# Altium schematic sheet lt3042_sch.SchDoc
size A4; Organization1: VINCULADA AO EXÉRCITO BRASILEIRO; Organization2: FÁBRICA DE MATERIAL DE; Organization3: COMUNICAÇÕES E ELETRÔNICA; Organization0: INDÚSTRIA DE MATERIAL BÉLICO DO BRASIL; Esquematico: Esquemático
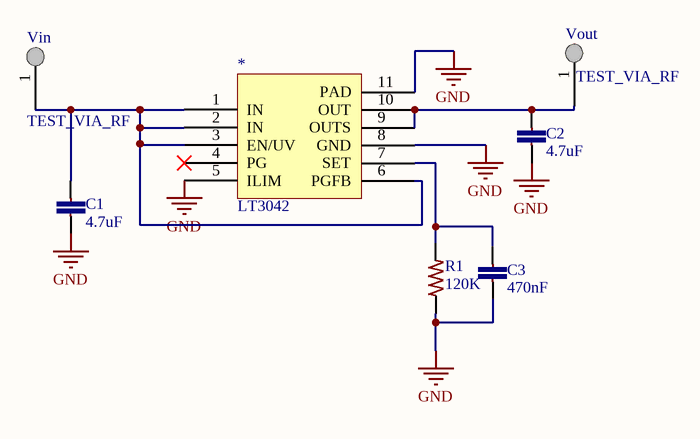
[diagram p0: lt3042_sch.SchDoc]

## Parts
*  LT3042  [TSSOP50P490X86-10N]
C1  4.7uF  [CAPC0603(1608)55_L]
C2  4.7uF  [CAPC0603(1608)55_L]
C3  470nF  [0603-CAP]
R1  120K  [0603-RES-HD]
Vin  TEST_VIA_RF  [New footprint 1]
Vout  TEST_VIA_RF  [New footprint 1]

## Nets
GND: *.5(ILIM) *.8(GND) *.11(PAD) C1.2 C2.2 C3.2 R1.1
Net*_1: *.1(IN) *.2(IN) *.3(EN/UV) *.6(PGFB) C1.1 Vin.1
Net*_7: *.7(SET) C3.1 R1.2
Net*_9: *.9(OUTS) *.10(OUT) C2.1 Vout.1

Not connected (* = marked no-connect by the designer): * 4(PG)*

## Notes on the sheet
- USADO EQUIP.:
- DATA:
- ENG:
- VERIF:
- HORA:
- REV:
- APROV:
- TÍTULO:
- FOLHA:
- /
- FORMATO:
- A4
- CÓDIGO:
- ESTOQUE:

## Library data of the parts
* = LT3042-01.A.1: IC REG LIN POS ADJ 200MA
C1 C2 = CC0603-4.7uF-6: CAP CER 4.7UF 6.3V 10% X5R 0603; Part No: JMK107BJ475KA-T; Cod EMS: 05.281.019.510; Value: 4.7u
C3 = CC0603-470nF-4: CAP CER 0.47uF 50V 10% X7R 0603; Part No: UMK107B7474KA-TR; Cod EMS: 05.281.019.647; Value: 470nF
R1 = R0603-120K-1: RES SMD 120K OHM 1% 1/10W 0603; Part No: ERJ-3EKF1203V; Family: ERJ-3EKF
Vin Vout = TEST_VIA_RF-01.A.1: Test VIA for RF circuits